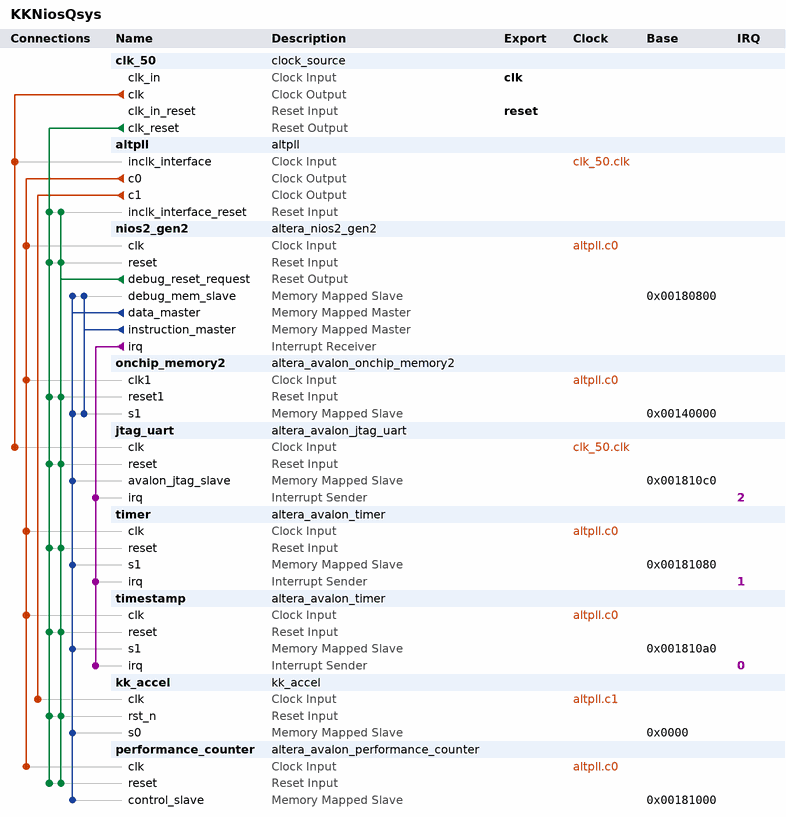
[diagram p0: system contents]
# Platform Designer (Qsys) system KKNiosQsys, Cyclone IV GX EP4CGX150DF31C7
# Parameters at their usual value, and those the tool derives, are not listed.
package require -exact qsys 14.1
create_system KKNiosQsys
set_project_property DEVICE_FAMILY {Cyclone IV GX}
set_project_property DEVICE EP4CGX150DF31C7

add_instance clk_50 clock_source 14.1
set_instance_parameter_value clk_50 clockFrequency 50000000

add_instance altpll altpll 14.1
set_instance_parameter_value altpll CLK0_DIVIDE_BY 2
set_instance_parameter_value altpll CLK0_MULTIPLY_BY 1
set_instance_parameter_value altpll CLK1_DIVIDE_BY 20
set_instance_parameter_value altpll CLK1_DUTY_CYCLE 50
set_instance_parameter_value altpll CLK1_MULTIPLY_BY 1
set_instance_parameter_value altpll CLK1_PHASE_SHIFT 0
set_instance_parameter_value altpll INCLK0_INPUT_FREQUENCY 20000
set_instance_parameter_value altpll PORT_ARESET PORT_USED
set_instance_parameter_value altpll PORT_LOCKED PORT_USED
set_instance_parameter_value altpll PORT_clk1 PORT_USED
set_instance_parameter_value altpll PORT_clk2 PORT_UNUSED
set_instance_parameter_value altpll PORT_clk3 PORT_UNUSED

add_instance nios2_gen2 altera_nios2_gen2 14.1
set_instance_parameter_value nios2_gen2 dcache_size 2048
set_instance_parameter_value nios2_gen2 exceptionSlave onchip_memory2.s1
set_instance_parameter_value nios2_gen2 icache_size 4096
set_instance_parameter_value nios2_gen2 impl Fast
set_instance_parameter_value nios2_gen2 resetSlave onchip_memory2.s1

add_instance onchip_memory2 altera_avalon_onchip_memory2 14.1
set_instance_parameter_value onchip_memory2 dataWidth 32
set_instance_parameter_value onchip_memory2 dualPort false
set_instance_parameter_value onchip_memory2 initMemContent true
set_instance_parameter_value onchip_memory2 initializationFileName onchip_mem.hex
set_instance_parameter_value onchip_memory2 memorySize 262144

add_instance jtag_uart altera_avalon_jtag_uart 14.1
set_instance_parameter_value jtag_uart simInteractiveOptions NO_INTERACTIVE_WINDOWS

add_instance timer altera_avalon_timer 14.1
set_instance_parameter_value timer period 1
set_instance_parameter_value timer periodUnits MSEC

add_instance timestamp altera_avalon_timer 14.1
set_instance_parameter_value timestamp period 1
set_instance_parameter_value timestamp periodUnits USEC

add_instance kk_accel kk_accel 1.0

add_instance performance_counter altera_avalon_performance_counter 14.1
set_instance_parameter_value performance_counter numberOfSections 5

# connections
add_connection altpll.c0 nios2_gen2.clk clock
add_connection altpll.c0 onchip_memory2.clk1 clock
add_connection altpll.c0 performance_counter.clk clock
add_connection altpll.c0 timer.clk clock
add_connection altpll.c0 timestamp.clk clock
add_connection altpll.c1 kk_accel.clk clock
add_connection clk_50.clk altpll.inclk_interface clock
add_connection clk_50.clk jtag_uart.clk clock
add_connection clk_50.clk_reset altpll.inclk_interface_reset reset
add_connection clk_50.clk_reset jtag_uart.reset reset
add_connection clk_50.clk_reset kk_accel.rst_n reset
add_connection clk_50.clk_reset nios2_gen2.reset reset
add_connection clk_50.clk_reset onchip_memory2.reset1 reset
add_connection clk_50.clk_reset performance_counter.reset reset
add_connection clk_50.clk_reset timer.reset reset
add_connection clk_50.clk_reset timestamp.reset reset
add_connection nios2_gen2.debug_reset_request altpll.inclk_interface_reset reset
add_connection nios2_gen2.debug_reset_request jtag_uart.reset reset
add_connection nios2_gen2.debug_reset_request kk_accel.rst_n reset
add_connection nios2_gen2.debug_reset_request nios2_gen2.reset reset
add_connection nios2_gen2.debug_reset_request onchip_memory2.reset1 reset
add_connection nios2_gen2.debug_reset_request performance_counter.reset reset
add_connection nios2_gen2.debug_reset_request timer.reset reset
add_connection nios2_gen2.debug_reset_request timestamp.reset reset
add_connection nios2_gen2.data_master jtag_uart.avalon_jtag_slave avalon
set_connection_parameter_value nios2_gen2.data_master/jtag_uart.avalon_jtag_slave baseAddress 0x001810c0
add_connection nios2_gen2.data_master kk_accel.s0 avalon
set_connection_parameter_value nios2_gen2.data_master/kk_accel.s0 baseAddress 0x0000
add_connection nios2_gen2.data_master nios2_gen2.debug_mem_slave avalon
set_connection_parameter_value nios2_gen2.data_master/nios2_gen2.debug_mem_slave baseAddress 0x00180800
add_connection nios2_gen2.data_master onchip_memory2.s1 avalon
set_connection_parameter_value nios2_gen2.data_master/onchip_memory2.s1 baseAddress 0x00140000
add_connection nios2_gen2.data_master performance_counter.control_slave avalon
set_connection_parameter_value nios2_gen2.data_master/performance_counter.control_slave baseAddress 0x00181000
add_connection nios2_gen2.data_master timer.s1 avalon
set_connection_parameter_value nios2_gen2.data_master/timer.s1 baseAddress 0x00181080
add_connection nios2_gen2.data_master timestamp.s1 avalon
set_connection_parameter_value nios2_gen2.data_master/timestamp.s1 baseAddress 0x001810a0
add_connection nios2_gen2.instruction_master nios2_gen2.debug_mem_slave avalon
set_connection_parameter_value nios2_gen2.instruction_master/nios2_gen2.debug_mem_slave baseAddress 0x00180800
add_connection nios2_gen2.instruction_master onchip_memory2.s1 avalon
set_connection_parameter_value nios2_gen2.instruction_master/onchip_memory2.s1 baseAddress 0x00140000
add_connection nios2_gen2.irq jtag_uart.irq interrupt
set_connection_parameter_value nios2_gen2.irq/jtag_uart.irq irqNumber 2
add_connection nios2_gen2.irq timer.irq interrupt
set_connection_parameter_value nios2_gen2.irq/timer.irq irqNumber 1
add_connection nios2_gen2.irq timestamp.irq interrupt
set_connection_parameter_value nios2_gen2.irq/timestamp.irq irqNumber 0

# exported interfaces
add_interface clk clock sink
set_interface_property clk EXPORT_OF clk_50.clk_in
add_interface reset reset sink
set_interface_property reset EXPORT_OF clk_50.clk_in_reset

set_interconnect_requirement {$system} qsys_mm.clockCrossingAdapter HANDSHAKE
set_interconnect_requirement {$system} qsys_mm.insertDefaultSlave FALSE
set_interconnect_requirement {$system} qsys_mm.maxAdditionalLatency 1

save_system KKNiosQsys.qsys
